# EAGLE design m1-alu (EAGLE 9.5.2)
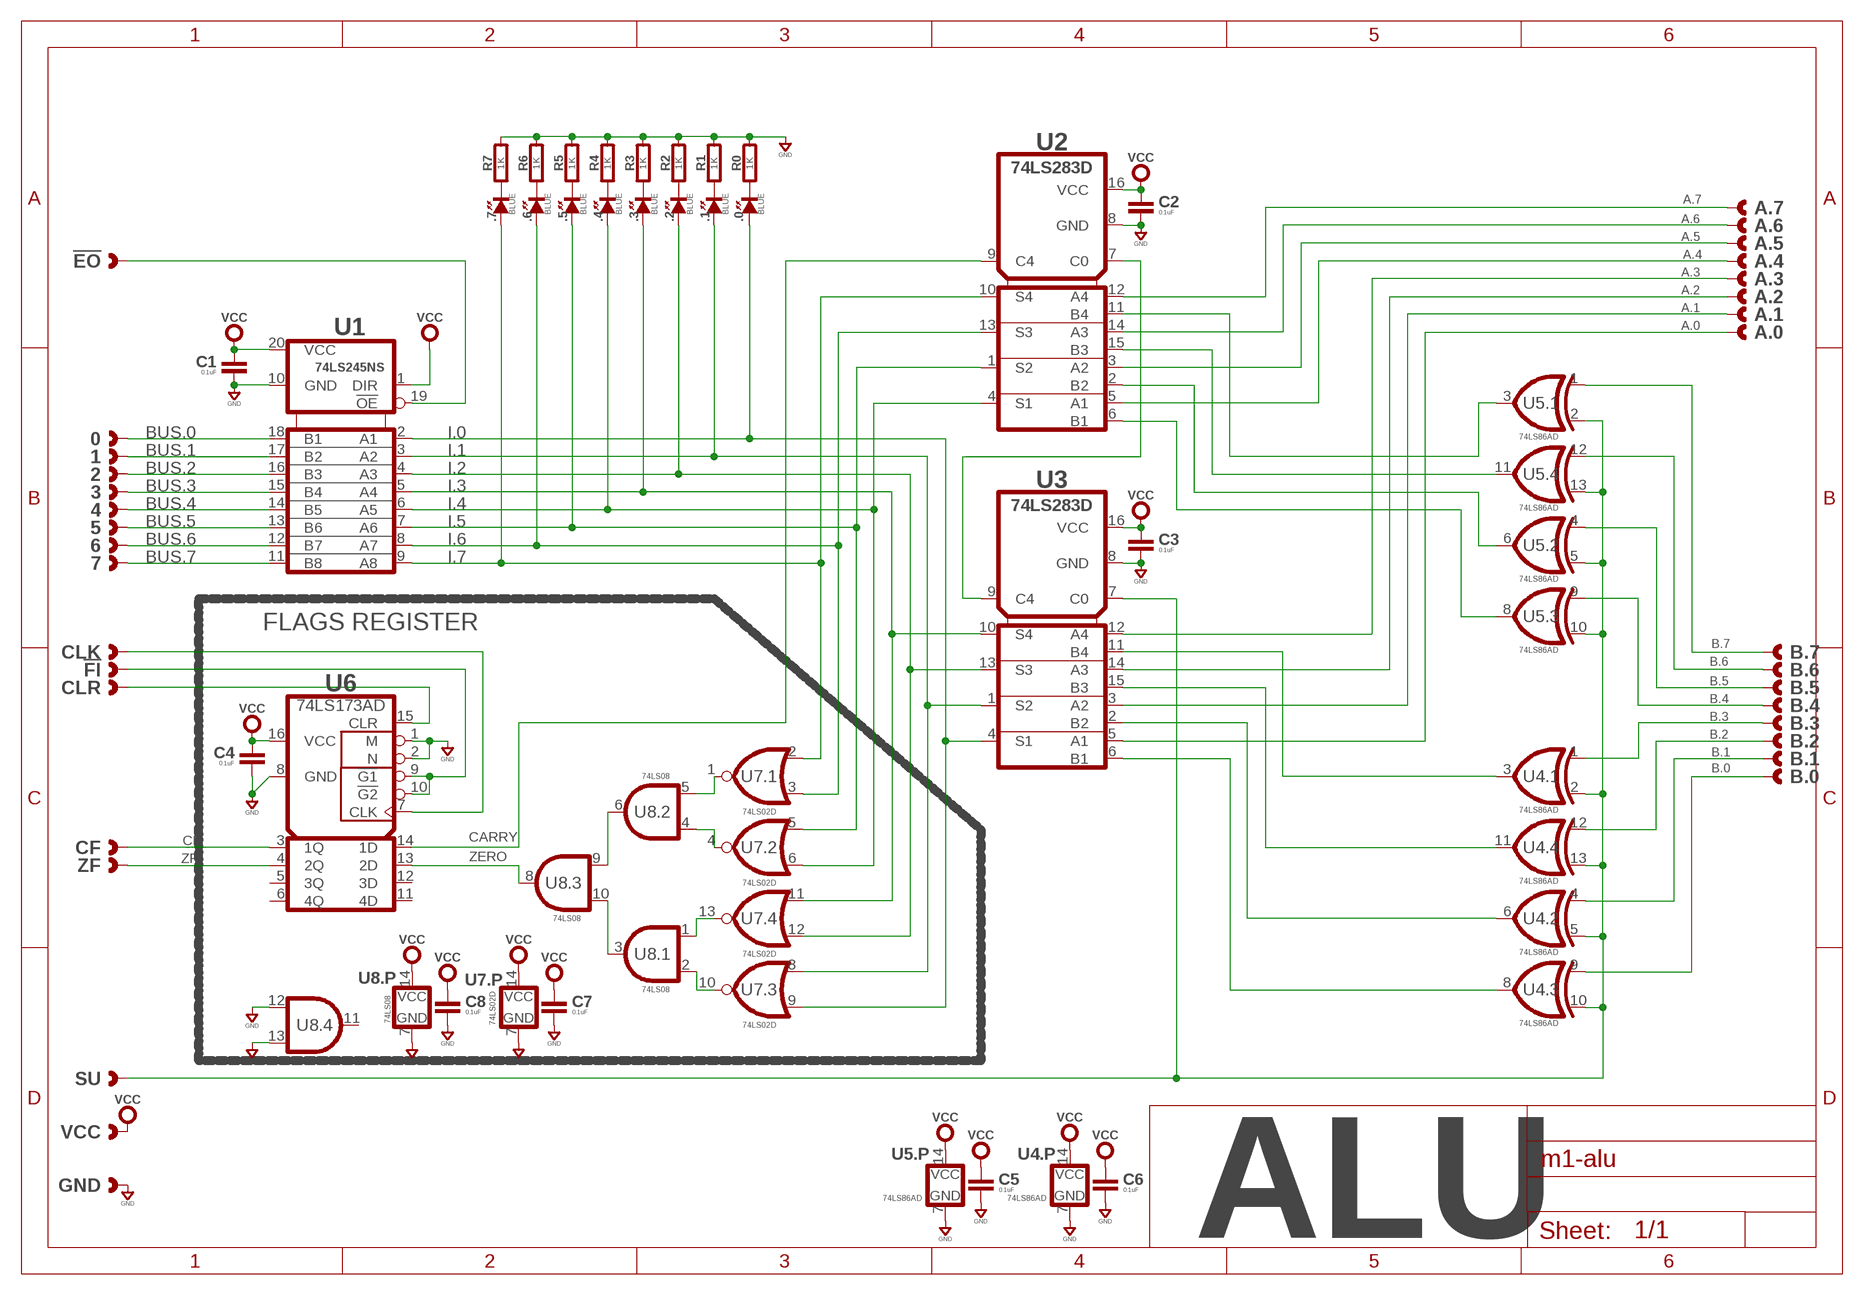
[diagram p0: schematic, sheet 1]

## Parts
0  CAST-01X1  [CAST01-2.54MM]
1  CAST-01X1  [CAST01-2.54MM]
2  CAST-01X1  [CAST01-2.54MM]
3  CAST-01X1  [CAST01-2.54MM]
4  CAST-01X1  [CAST01-2.54MM]
5  CAST-01X1  [CAST01-2.54MM]
6  CAST-01X1  [CAST01-2.54MM]
7  CAST-01X1  [CAST01-2.54MM]
!EO  CAST-01X1  [CAST01-2.54MM]
!FI  CAST-01X1  [CAST01-2.54MM]
.0  BLUE  SMT0603  [SMD_0603]
.1  BLUE  SMT0603  [SMD_0603]
.2  BLUE  SMT0603  [SMD_0603]
.3  BLUE  SMT0603  [SMD_0603]
.4  BLUE  SMT0603  [SMD_0603]
.5  BLUE  SMT0603  [SMD_0603]
.6  BLUE  SMT0603  [SMD_0603]
.7  BLUE  SMT0603  [SMD_0603]
A.0  CAST-01X1  [CAST01-2.54MM]
A.1  CAST-01X1  [CAST01-2.54MM]
A.2  CAST-01X1  [CAST01-2.54MM]
A.3  CAST-01X1  [CAST01-2.54MM]
A.4  CAST-01X1  [CAST01-2.54MM]
A.5  CAST-01X1  [CAST01-2.54MM]
A.6  CAST-01X1  [CAST01-2.54MM]
A.7  CAST-01X1  [CAST01-2.54MM]
B.0  CAST-01X1  [CAST01-2.54MM]
B.1  CAST-01X1  [CAST01-2.54MM]
B.2  CAST-01X1  [CAST01-2.54MM]
B.3  CAST-01X1  [CAST01-2.54MM]
B.4  CAST-01X1  [CAST01-2.54MM]
B.5  CAST-01X1  [CAST01-2.54MM]
B.6  CAST-01X1  [CAST01-2.54MM]
B.7  CAST-01X1  [CAST01-2.54MM]
C1  0.1uF  CAPACITOR0603  [0603-CAP]
C2  0.1uF  CAPACITOR0603  [0603-CAP]
C3  0.1uF  CAPACITOR0603  [0603-CAP]
C4  0.1uF  CAPACITOR0603  [0603-CAP]
C5  0.1uF  CAPACITOR0603  [0603-CAP]
C6  0.1uF  CAPACITOR0603  [0603-CAP]
C7  0.1uF  CAPACITOR0603  [0603-CAP]
C8  0.1uF  CAPACITOR0603  [0603-CAP]
CF  CAST-01X1  [CAST01-2.54MM]
CLK  CAST-01X1  [CAST01-2.54MM]
CLR  CAST-01X1  [CAST01-2.54MM]
GND  CAST-01X1  [CAST01-2.54MM]
R0  1K  RESISTOR0603  [0603-RES]
R1  1K  RESISTOR0603  [0603-RES]
R2  1K  RESISTOR0603  [0603-RES]
R3  1K  RESISTOR0603  [0603-RES]
R4  1K  RESISTOR0603  [0603-RES]
R5  1K  RESISTOR0603  [0603-RES]
R6  1K  RESISTOR0603  [0603-RES]
R7  1K  RESISTOR0603  [0603-RES]
SU  CAST-01X1  [CAST01-2.54MM]
U1  74LS245NS  [SO20]
U2  74LS283D  [SO16]
U3  74LS283D  [SO16]
U4  74LS86AD  74LS86D  [SOP14]
U5  74LS86AD  74LS86D  [SOP14]
U6  74LS173AD  [SO16]
U7  74LS02D  [SOP14]
U8  74LS08  74LS08D  [SOP14]
VCC  CAST-01X1  [CAST01-2.54MM]
ZF  CAST-01X1  [CAST01-2.54MM]

## Nets
A.0: A.0.1 U3.5(A1)
A.1: A.1.1 U3.3(A2)
A.2: A.2.1 U3.14(A3)
A.3: A.3.1 U3.12(A4)
A.4: A.4.1 U2.5(A1)
A.5: A.5.1 U2.3(A2)
A.6: A.6.1 U2.14(A3)
A.7: A.7.1 U2.12(A4)
B.0: B.0.1 U4.9(.3:A)
B.1: B.1.1 U4.4(.2:A)
B.2: B.2.1 U4.12(.4:A)
B.3: B.3.1 U4.1(.1:A)
B.4: B.4.1 U5.9(.3:A)
B.5: B.5.1 U5.4(.2:A)
B.6: B.6.1 U5.12(.4:A)
B.7: B.7.1 U5.1(.1:A)
BUS.0: 0.1 U1.18(B1)
BUS.1: 1.1 U1.17(B2)
BUS.2: 2.1 U1.16(B3)
BUS.3: 3.1 U1.15(B4)
BUS.4: 4.1 U1.14(B5)
BUS.5: 5.1 U1.13(B6)
BUS.6: 6.1 U1.12(B7)
BUS.7: 7.1 U1.11(B8)
CARRY: U2.9(C4) U6.14(1D)
CF: CF.1 U6.3(1Q)
GND: C1.2 C2.2 C3.2 C4.2 C5.2 C6.2 C7.2 C8.2 GND.1 R0.2 R1.2 R2.2 R3.2 R4.2 R5.2 R6.2 R7.2 U1.10(GND) U2.8(GND) U3.8(GND) U4.7(.P:GND) U5.7(.P:GND) U6.1(M) U6.2(N) U6.8(GND) U7.7(.P:GND) U8.7(.P:GND) U8.12(.4:A) U8.13(.4:B)
I.0: .0.A U1.2(A1) U3.4(S1) U7.9(.3:B)
I.1: .1.A U1.3(A2) U3.1(S2) U7.8(.3:A)
I.2: .2.A U1.4(A3) U3.13(S3) U7.12(.4:B)
I.3: .3.A U1.5(A4) U3.10(S4) U7.11(.4:A)
I.4: .4.A U1.6(A5) U2.4(S1) U7.6(.2:B)
I.5: .5.A U1.7(A6) U2.1(S2) U7.5(.2:A)
I.6: .6.A U1.8(A7) U2.13(S3) U7.3(.1:B)
I.7: .7.A U1.9(A8) U2.10(S4) U7.2(.1:A)
N$33: U2.7(C0) U3.9(C4)
N$34: SU.1 U3.7(C0) U4.2(.1:B) U4.5(.2:B) U4.10(.3:B) U4.13(.4:B) U5.2(.1:B) U5.5(.2:B) U5.10(.3:B) U5.13(.4:B)
N$35: U2.11(B4) U5.3(.1:Y)
N$36: U2.15(B3) U5.11(.4:Y)
N$37: U2.2(B2) U5.6(.2:Y)
N$38: U2.6(B1) U5.8(.3:Y)
N$39: U3.6(B1) U4.8(.3:Y)
N$40: U3.2(B2) U4.6(.2:Y)
N$41: U3.15(B3) U4.11(.4:Y)
N$42: U3.11(B4) U4.3(.1:Y)
N$43: U7.1(.1:Y) U8.5(.2:B)
N$44: U7.4(.2:Y) U8.4(.2:A)
N$45: U8.6(.2:Y) U8.9(.3:A)
N$46: U8.3(.1:Y) U8.10(.3:B)
N$47: U7.13(.4:Y) U8.1(.1:A)
N$48: U7.10(.3:Y) U8.2(.1:B)
N$49: !EO.1 U1.19(!OE)
N$50: .0.K(C) R0.1
N$51: .1.K(C) R1.1
N$52: .2.K(C) R2.1
N$53: .3.K(C) R3.1
N$54: .4.K(C) R4.1
N$55: .5.K(C) R5.1
N$56: .6.K(C) R6.1
N$57: .7.K(C) R7.1
N$58: !FI.1 U6.9(!G1) U6.10(!G2)
N$59: CLK.1 U6.7(CLK)
N$60: CLR.1 U6.15(CLR)
N$61: U1.1(DIR) ; supply symbol labelled VCC
VCC: C1.1 C2.1 C3.1 C4.1 C5.1 C6.1 C7.1 C8.1 U1.20(VCC) U2.16(VCC) U3.16(VCC) U4.14(.P:VCC) U5.14(.P:VCC) U6.16(VCC) U7.14(.P:VCC) U8.14(.P:VCC) VCC.1
ZERO: U6.13(2D) U8.8(.3:Y)
ZF: U6.4(2Q) ZF.1
Unconnected: U6.5(3Q) U6.6(4Q) U6.11(4D) U6.12(3D) U8.11(.4:Y)

## Notes on the sheet
- FLAGS REGISTER
- ALU

## Library data of the parts
0 1-7 !EO !FI A.0 A.1-A.7 B.0 B.1-B.7 CF CLK CLR GND SU VCC ZF = con-headers:CAST-01X1: Castelated Edge Hole Pad
.0 .1-.7 = led:SMT: LED SMT
C1-C8 = rlc:CAPACITOR: Capacitor CAP
R0 R1-R7 = rlc:RESISTOR: Resistor
U1 = logic:74*245?: 74245 Octal Transceiver
U2 U3 = logic:74*283?: 4-bit Adder
U4 U5 = logic:74*86?: Quad XOR Gate
U6 = logic:74*173A?: 74*173 Logic
U7 = logic:74*02?: Quad NOR Gate
U8 = logic:74*08?: 7408 Quad AND Gate

## Board
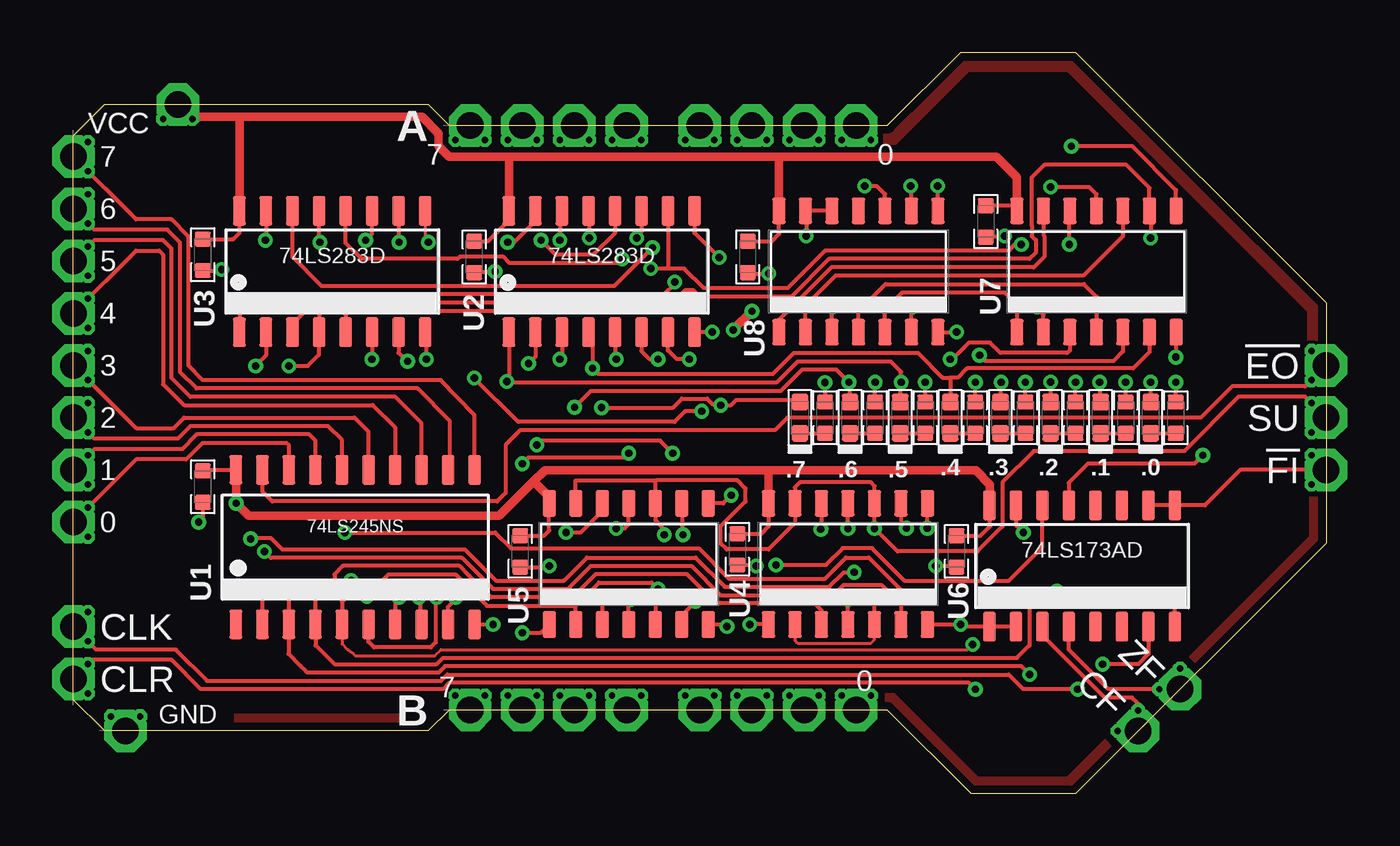
[diagram p1: board, top side]
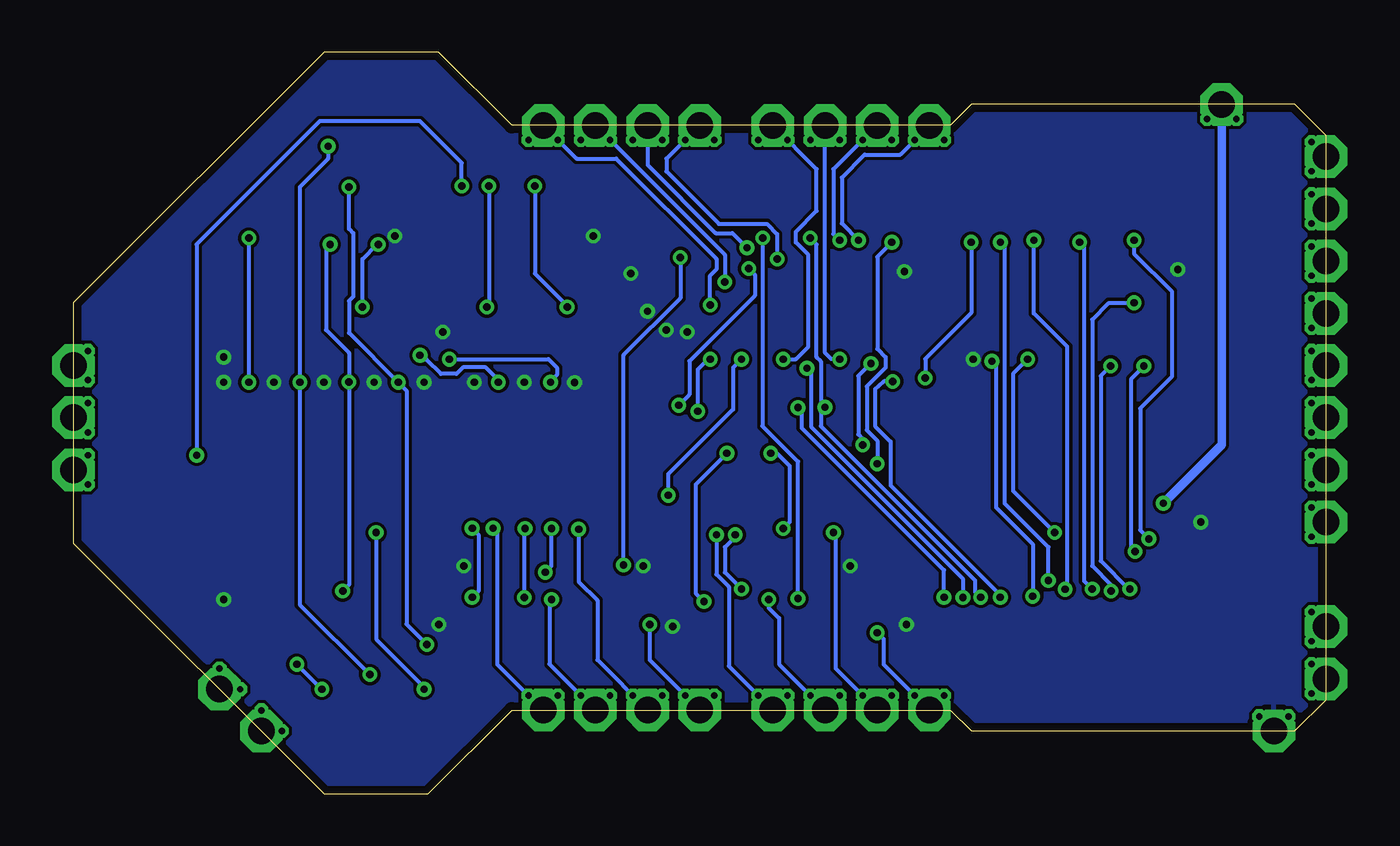
[diagram p2: board, bottom side, seen from below]

Size 60 x 35.5 mm. Coordinates in mm from the lower left corner, seen from the top.
Outline: 0,4.5 0,31.5 1.5,33 17,33 18,32 39,32 42.5,35.5 48,35.5 60,23.5 60,12 48,0 43,0 39,4 18,4 17,3 1.5,3 0,4.5
Copper layers (1*16): Top 0.0356mm / dielectric 1.5011mm / Bottom 0.0356mm
Design rules "OSH-CircuitMonkey *": minimum track width 6mil, minimum drill 13mil, track to track 6mil, track to pad 6mil, pad to pad 6mil, via to via 6mil, smd to smd 6mil, copper to edge 15mil, drill to drill 6mil, minimum pad ring 7mil, minimum via ring 7mil, stop-mask expansion 3mil, vias tented up to drill 14mil, thermal gap 10mil

### Footprints (pad centres in the part's own frame; a part is rotated, then mirrored left to right if it is on the bottom)
CAST01-2.54MM = drill 1.27 pad 2.032 octagon: 1 0,0 | drill 0.305 octagon: P$1 -0.7,0.7; P$2 -0.7,-0.7
SMD_0603 = smd 0.8 x 0.8: A 0.75,0; K -0.75,0
0603-CAP = smd 0.711 x 0.762: 1 -0.752,0; 2 0.752,0
0603-RES = smd 0.711 x 0.762: 1 -0.752,0; 2 0.752,0
SO20 = smd 0.6 x 1.4: 1 -5.715,-3.7; 2 -4.445,-3.7; 3 -3.175,-3.7; 4 -1.905,-3.7; 5 -0.635,-3.7; 6 0.635,-3.7; 7 1.905,-3.7; 8 3.175,-3.7; 9 4.445,-3.7; 10 5.715,-3.7; 11 5.715,3.7; 12 4.445,3.7; 13 3.175,3.7; 14 1.905,3.7; 15 0.635,3.7; 16 -0.635,3.7; 17 -1.905,3.7; 18 -3.175,3.7; 19 -4.445,3.7; 20 -5.715,3.7
SO16 = smd 0.6 x 1.4: 1 -4.445,-2.9; 2 -3.175,-2.9; 3 -1.905,-2.9; 4 -0.635,-2.9; 5 0.635,-2.9; 6 1.905,-2.9; 7 3.175,-2.9; 8 4.445,-2.9; 9 4.445,2.9; 10 3.175,2.9; 11 1.905,2.9; 12 0.635,2.9; 13 -0.635,2.9; 14 -1.905,2.9; 15 -3.175,2.9; 16 -4.445,2.9
SOP14 = smd 1.27 x 0.635: 1 -2.9,3.81; 2 -2.9,2.54; 3 -2.9,1.27; 4 -2.9,0; 5 -2.9,-1.27; 6 -2.9,-2.54; 7 -2.9,-3.81; 8 2.9,-3.81; 9 2.9,-2.54; 10 2.9,-1.27; 11 2.9,0; 12 2.9,1.27; 13 2.9,2.54; 14 2.9,3.81

### Placement (x,y rotation side)
0  0,13 180 top
1  0,15.5 180 top
2  0,18 180 top
3  0,20.5 180 top
4  0,23 180 top
5  0,25.5 180 top
6  0,28 180 top
7  0,30.5 180 top
!EO  60,20.5 0 top
!FI  60,15.5 0 top
.0  51.6,18 90 top
.1  49.2,18 90 top
.2  46.8,18 90 top
.3  44.4,18 90 top
.4  42,18 90 top
.5  39.6,18 90 top
.6  37.2,18 90 top
.7  34.8,18 90 top
A.0  37.5,32 90 top
A.1  35,32 90 top
A.2  32.5,32 90 top
A.3  30,32 90 top
A.4  26.5,32 90 top
A.5  24,32 90 top
A.6  21.5,32 90 top
A.7  19,32 90 top
B.0  37.5,4 270 top
B.1  35,4 270 top
B.2  32.5,4 270 top
B.3  30,4 270 top
B.4  26.5,4 270 top
B.5  24,4 270 top
B.6  21.5,4 270 top
B.7  19,4 270 top
C1  6.2,14.7 270 top
C2  19.2,25.7 270 top
C3  6.2,25.8 270 top
C4  31.8,11.7 270 top
C5  21.4,11.6 270 top
C6  42.3,11.6 270 top
C7  43.7,27.4 270 top
C8  32.3,25.7 270 top
CF  51,3 315 top
CLK  0,8 180 top
CLR  0,5.5 180 top
GND  2.5,3 270 top
R0  52.8,18 90 top
R1  50.4,18 90 top
R2  48,18 90 top
R3  45.6,18 90 top
R4  43.2,18 90 top
R5  40.8,18 90 top
R6  38.4,18 90 top
R7  36,18 90 top
SU  60,18 0 top
U1  13.5,11.8 0 top
U2  25.3,25 0 top
U3  12.4,25 0 top
U4  37.1,11 90 top
U5  26.6,11 90 top
U6  48.31,10.9 0 top
U7  49,25 90 top
U8  37.6,25 90 top
VCC  5,33 90 top
ZF  53,5 315 top

### Tracks (layer width: path | path; a pad name or v marks a point on that pad's centre or on a via)
A.0  (via drill 0.35)
  Top 0.2: v29.5,23.4 29.2,23.1 13.2,23.1 13.04,22.93 U3.5
  Bottom 0.2: A.0.1 35.9,30.4 34,30.4 29.2,25.6 29.2,25.1 29.5,24.8 v29.5,23.4
A.1  (via drill 0.35)
  Top 0.2: v28.8,24.5 28.8,24.4 28.3,23.9 11.9,23.9 10.49,22.5 U3.3
  Bottom 0.2: A.1.1 28.8,25.8 v28.8,24.5
A.2  (via drill 0.35)
  Top 0.2: v27.74,26.14 25.9,24.3 11.9,24.3 10.49,25.7 U3.14
  Bottom 0.2: A.2.1 32.5,30.1 29.24,26.84 28.44,26.84 v27.74,26.14
A.3  (via drill 0.35)
  Top 0.2: v26.3,25.59 26.1,25.4 20.9,25.4 20.6,25.7 18.5,25.7 18.4,25.6 13.8,25.6 13.04,26.36 U3.12
  Bottom 0.2: v26.3,25.59 26.3,26.8 26.78,27.28 29.09,27.28 31.6,29.8 31.6,30.4 A.3.1
A.4  (via drill 0.35)
  Top 0.2: v26,20.8 25.94,20.86 U2.5
  Bottom 0.2: A.4.1 24.4,29.9 24.4,27.9 25.4,26.9 25.4,26.4 24.8,25.8 24.8,21.4 25.4,20.8 v26,20.8
A.5  (via drill 0.35)
  Top 0.2: U2.3 23.4,20.9 v23.3,20.8
  Bottom 0.2: A.5.1 24,21.1 23.7,20.8 v23.3,20.8
A.6  (via drill 0.35)
  Top 0.2: U2.14 23.3,27.8 v23.3,26.5
  Bottom 0.2: v23.3,26.5 23.6,26.8 23.6,29.9 A.6.1
A.7  (via drill 0.35)
  Top 0.2: v22.4,26.5 23.1,25.8 24.9,25.8 25.94,26.84 U2.12
  Bottom 0.2: A.7.1 20.4,30.6 22.1,30.6 23.2,29.5 23.2,27.3 v22.4,26.5
AAA
  pour Top: 15.7,3.4 15.7,3.8 7.7,3.8 7.7,3.4
B.0  (via drill 0.35)
  Top 0.2: U4.9 39.64,12.96 v39.9,12.71
  Bottom 0.2: B.0.1 39.7,6.2 39.7,12.51 v39.9,12.71
B.1  (via drill 0.35)
  Top 0.2: U4.4 v37.1,9.3
  Bottom 0.2: B.1.1 37.2,6.2 37.2,9.2 v37.1,9.3
B.2  (via drill 0.35)
  Top 0.2: U4.12 35.83,12.65 v35.8,12.65
  Bottom 0.2: B.2.1 34.9,6.4 34.9,9.25 35.8,10.16 v35.8,12.65
B.3  (via drill 0.35)
  Top 0.2: U4.1 v32.4,8.1
  Bottom 0.2: v32.4,8.1 32.4,6.4 B.3.1
B.4  (via drill 0.35)
  Top 0.2: U5.9 29.14,12.46 v29.2,12.4
  Bottom 0.2: B.4.1 28.6,6.1 28.6,9.9 29.2,10.5 v29.2,12.4
B.5  (via drill 0.35)
  Top 0.2: U5.4 26.6,9.2 v26.7,9.3
  Bottom 0.2: B.5.1 26.2,6.2 26.2,8.4 26.7,8.9 v26.7,9.3
B.6  (via drill 0.35)
  Top 0.2: U5.12 25.33,13.53 24.3,12.5 v23.6,12.5
  Bottom 0.2: B.6.1 23.5,6 23.5,12.4 v23.6,12.5
B.7  (via drill 0.35)
  Top 0.2: v21.5,7.71 22.39,7.71 U5.1
  Bottom 0.2: B.7.1 21.2,6.2 21.2,7.41 v21.5,7.71
BBB
  pour Top: 38.8,31.6 38.8,31.1 39.4,31.1 42.9,34.6 47.6,34.6 59.1,23.1 59.1,21.7 59.6,21.7 59.6,23.4 47.9,35.1 42.6,35.1 39.1,31.6
BUS.0
  Top 0.2: U1.18 10.32,16.68 10.2,16.8 6.2,16.8 5.4,16 3,16 0.1
BUS.1
  Top 0.2: U1.17 11.6,16.9 11.3,17.2 5.9,17.2 5.2,16.5 1,16.5 1.1
BUS.2
  Top 0.2: U1.16 12.87,16.93 12.2,17.6 5.6,17.6 5,17 1,17 2.1
BUS.3
  Top 0.2: U1.15 14.13,17.33 13.47,18 5.3,18 4.8,17.5 3,17.5 3.1
BUS.4
  Top 0.2: U1.14 15.4,17.53 14.34,18.6 5.3,18.6 4.3,19.6 4.3,25.8 4.1,26 3,26 4.1
BUS.5
  Top 0.2: U1.13 16.68,17.73 15.41,19 5.6,19 4.7,19.9 4.7,26.1 4.3,26.5 1,26.5 5.1
BUS.6
  Top 0.2: U1.12 18.03,15.58 18.03,17.85 16.48,19.4 5.9,19.4 5.1,20.2 5.1,26.4 4.5,27 1,27 6.1
BUS.7
  Top 0.2: U1.11 19.21,18.12 17.59,19.8 6.2,19.8 5.5,20.5 5.5,26.7 4.7,27.5 3,27.5 7.1
CARRY  (via drill 0.35)
  Top 0.2: U2.9 29.75,26.85 v30.93,25.67 | v33.65,10.95 36.05,10.95 36.85,11.75 38.25,11.75 39.8,10.2 44.8,10.2 46.41,11.81 U6.14
  Bottom 0.2: v30.93,25.67 30.93,23.73 33.65,21.01 v33.65,10.95
CCC
  pour Top: 38.9,4.4 38.9,4.8 39.3,4.8 43.3,0.8 47.6,0.8 49.4,2.6 49.75,2.25 47.9,0.4 43.1,0.4 39.1,4.4
CF
  Top 0.2: CF.1 51,4.3 50.7,4.6 49.4,4.6 46.41,7.59 U6.3
EEE
  pour Top: 59.6,14.2 59.2,14.2 59.2,12.3 53.45,6.55 53.75,6.25 59.6,12.1
GND  (via drill 0.35)
  Top 0.2: U3.8 16.9,22.05 v16.9,20.8 | v36,19.69 R7.2 | R6.2 38.4,19.25 | 38.4,19.25 | 38.4,19.25 v38.4,19.7 | R5.2 40.8,19.25 | 40.8,19.25 | 40.8,19.25 v40.8,19.7 | R4.2 43.2,19.25 | 43.2,19.25 | 43.2,19.25 v43.2,19.7 | R3.2 45.6,19.25 | 45.6,19.25 | 45.6,19.25 v45.6,19.7 | R2.2 48,19.25 | 48,19.25 | 48,19.25 v48,19.7 | R1.2 50.4,19.25 | 50.4,19.25 | 50.4,19.25 v50.4,19.7 | v52.8,19.7 52.8,19.25 | R0.2 52.8,19.25 | 52.8,19.25 | C3.2 7.05,25.05 v7.1,25.1 | C2.2 19.25,25 v20.2,25 | U1.10 v20.1,8.1 | C5.2 22.75,10.85 v22.8,10.9 | U6.2 U6.1 42.6,8 v42.5,8.1 U4.7 | U5.7 31.2,8.1 v31.3,8 | C4.2 32.65,10.95 v32.7,10.9 | U8.7 v42.3,22.1 | U6.8 52.76,9.26 v52.8,9.3 | v41.3,10.9 42.25,10.9 C6.2 | C1.2 6.2,13.2 v6,13 | U2.8 v30.6,22.1 | C8.2 32.35,24.9 v33.3,24.9 | U8.12 U8.13 35.1,27.86 v35.1,26.7 | C7.2 43.75,26.7 v44.6,26.7 | U7.7 v52.81,20.91 v52.8,20.9
  Top 0.406: v32.5,23.1 v31.6,22.2
  pour Bottom: 0,4.5 1.5,3 17,3 18,4 39,4 43,0 48,0 60,12 60,23.5 48,35.5 42.5,35.5 39,32 18,32 17,33 1.5,33 0,31.5
I.0  (via drill 0.35)
  Top 0.2: U1.2 9.05,9.46 v9.4,9.8 | v10.32,20.48 11.22,20.48 11.75,21 11.75,22.08 U3.4 11.77,23.07 12.2,23.5 28.7,23.5 29.3,24.1 29.7,24.1 30,23.8 34.4,23.8 36.2,25.6 45.8,25.6 46.1,25.9 46.1,26.5 45.9,26.7 45.9,27.21 45.89,27.22 45.89,29.49 46.5,30.1 50.44,30.1 51.54,29 U7.9 51.6,27.84 v51.6,26.6 | .0.A v51.6,19.7
  Bottom 0.2: v9.4,9.8 9.43,9.77 10.8,11.14 10.8,20 v10.32,20.48 | v51.6,26.6 v51.6,19.7
I.1  (via drill 0.35)
  Top 0.2: U1.3 10.32,9.68 v10.3,9.7 10.3,6.69 10.89,6.1 11.1,5.9 11.2,5.8 17.5,5.8 17.8,6.1 45.4,6.1 v45.8,5.7 | v9.2,23.5 8.4,23.5 7.96,23.05 U3.1 | U7.8 52.81,28.9 50.71,31 v47.8,31 | v49.15,19.7 49.15,18.8 .1.A
  Bottom 0.2: v10.3,9.7 10.3,10 11.2,10.9 11.2,22.7 10.4,23.5 v9.2,23.5 | v45.8,5.7 49.15,9.05 v49.15,19.7 49.15,29.05 47.8,30.4 v47.8,31
I.2  (via drill 0.35)
  Top 0.2: v11.2,9.8 11.6,9.41 U1.4 11.6,7.11 12.5,6.2 17.4,6.2 17.7,6.5 45.2,6.5 45.8,7.1 45.8,9 46.5,9.7 v47.1,9.7 | v11.8,26.41 11.77,26.44 U3.13 | v46.8,19.7 .2.A | v47.7,26.3 47.7,27.87 U7.12
  Bottom 0.2: v11.2,9.8 11.6,10.2 11.6,26.2 v11.8,26.4 v11.8,26.41 | v47.1,9.7 46.8,10 v46.8,19.7 46.8,21.1 47.9,22.2 47.9,26.1 v47.7,26.3
I.3  (via drill 0.35)
  Top 0.152: U1.5 12.87,7.17 13.13,6.9 13.4,6.7 13.5,6.6 17.3,6.6 17.6,6.9 42.83,6.9 v43.07,7.14
  Top 0.2: U3.10 15.57,26.41 v15.6,26.41 | v13.3,10.2 13.3,9.63 12.87,9.2 U1.5 | v44.44,19.7 44.4,19.66 .3.A | U7.11 49,28.7 48.66,29.04 v46.8,29.04
  Bottom 0.2: v15.6,26.41 15.4,26.2 15.4,13.9 13.3,11.8 v13.3,10.2 | v46.8,29.04 46.8,27.04 46.6,26.84 46.6,23.8 46.8,23.6 46.8,22.06 v44.44,19.7 44.04,19.3 44.04,8.11 v43.07,7.14
I.4  (via drill 0.35)
  Top 0.2: U2.4 24.87,21.9 v24.87,20.37 25.13,20.11 33.51,20.11 34.5,21.1 40.45,21.1 41.62,19.93 42,19.93 | v17.4,9.39 17.36,9.35 17.36,7.25 17.11,7 14.4,7 14.13,7.26 U1.6 | U7.6 51.54,21.14 50.76,20.36 42.8,20.36 42.37,19.93 42,19.93 | 42,19.93 .4.A
  Bottom 0.2: v17.4,9.39 17.4,10.3 24.67,17.57 24.67,20.17 v24.87,20.37
I.5  (via drill 0.35)
  Top 0.2: U2.1 20.86,19.84 v20.76,19.74 20.8,19.7 33.7,19.7 34.7,20.7 39.14,20.7 39.64,20.2 v39.64,19.7 39.59,19.7 .5.A | v15.61,9.41 v15.61,9.4 15.4,9.2 U1.7 | U7.5 50.27,21.18 49.8,20.71 43.69,20.71 v43.4,21
  Bottom 0.2: v20.76,19.74 21.18,19.74 21.6,19.35 21.6,17.6 20.86,16.86 20.86,14.76 15.61,9.5 v15.61,9.41 | v39.64,19.7 39.64,19.8 40.25,20.41 41.34,20.41 41.65,20.09 42.4,20.09 43.1,20.8 43.2,20.8 v43.4,21
I.6  (via drill 0.35)
  Top 0.2: U1.8 16.6,8.18 16.6,9.34 v16.54,9.4 | U2.13 24.7,27.86 v24.7,26.61 | U7.3 47.73,21.23 47.6,21.1 44.4,21.1 43.9,21.6 42.9,21.6 42.16,20.86 42.06,20.86 v42,20.8 | v24,18.5 24.79,19.29 33.89,19.29 34.9,20.3 36.54,20.3 v37.14,19.7 37.18,19.66 37.18,18.77 .6.A
  Bottom 0.2: v16.54,9.4 16.8,9.66 16.8,10.2 24.2,17.6 24.2,18.3 v24,18.5 24.2,18.7 24.2,20.7 24.4,20.9 24.4,26.3 v24.7,26.61 | v37.14,19.7 36.84,20.05 36.84,20.4 37.24,20.8 v42,20.8
I.7  (via drill 0.35)
  Top 0.2: .7.A 34.7,18.85 31.75,18.85 31.5,18.6 v31,18.6 31,18.65 30.61,18.65 30.35,18.91 29.15,18.91 28.72,18.48 v25.3,18.48 | U7.2 46.46,22.94 46.16,23.24 v46.16,23.3 | v45.4,26.3 45.1,26.3 44.8,26 36,26 34.2,24.2 30.2,24.2 29.26,25.14 28.5,25.14 | U1.9 17.95,8.95 18.3,9.3 v18.3,9.4 | 28.5,25.14 v27.66,25.14 | 28.5,25.14 28.48,25.16 U2.10
  Bottom 0.2: v27.66,25.14 27.36,24.84 27.36,23.84 30.5,20.7 30.5,19.11 v31,18.6 | v46.16,23.3 46.16,25.59 45.46,26.3 v45.4,26.3 | v18.3,9.4 18.3,10.7 25.12,17.52 25.12,18.3 v25.3,18.48
N$33  (via drill 0.35)
  Top 0.152: U3.9 16.84,26.56 v17,26.41 | v30.1,18.3 30.08,18.33 30,18.3
  Top 0.2: v19.2,19.9 21.3,17.8 28.8,17.8 29.3,18.3 30,18.3 | v29.5,20.8 28.9,20.8 28.48,21.22 U2.7
  Bottom 0.2: v17,26.41 17,23.02 19.2,20.82 v19.2,19.9 | v30.1,18.3 30.1,20.3 29.6,20.8 v29.5,20.8
N$34  (via drill 0.35)
  Top 0.152: U4.2 34.56,7.34 34.69,7.21 38.21,7.21 38.37,7.37 U4.5
  Top 0.2: SU.1 59,19 55.8,19 53.2,16.4 46,16.4 44.5,14.9 44.5,12.8 43.3,11.6 39.47,11.6 v38.37,12.7 U4.10 38.37,14.73 38.2,14.9 34.8,14.9 34.56,14.66 U4.13 34.56,12.96 33.3,11.7 31.3,11.7 31,12 31,12.8 32.2,14 32.2,14.6 31.8,15 27.87,15 | v16,20.7 15.97,20.7 15.57,21.1 U3.7 | v14.05,9.45 15.1,10.5 18.3,10.5 19.81,8.99 24.06,8.99 | v28.3,12.4 28.3,12.67 27.87,13.1 U5.10 27.87,15 | U5.13 24.06,15 27.87,15 | U5.5 27.87,9.67 v28,9.8 27.7,10.1 25.17,10.1 24.06,8.99 | U5.2 24.06,8.99 | U4.5 38.37,9.27 38.4,9.3 v38.4,9.39
  Bottom 0.2: v16,20.7 15.8,20.5 15.8,13.71 14.05,11.95 v14.05,9.45 | v28.3,12.4 28.3,12.3 28.8,11.8 28.8,10.6 v28,9.8 | v38.4,9.39 38.4,12.7 v38.37,12.7
N$35  (via drill 0.35)
  Top 0.2: v25.3,9.34 25.33,9.3 U5.3 | U2.11 27.21,26.91 26.98,26.68 v26.98,26.6
  Bottom 0.2: v25.3,9.34 25.3,15.89 27,17.6 27,26.58 v26.98,26.6
N$36  (via drill 0.35)
  Top 0.2: U2.15 22.13,27.43 21.1,26.4 v20.8,26.4 | v26.6,16.3 26.4,16.09 21.8,16.09 v21.5,15.8 | v26,12.7 26.4,12.7 26.6,12.9 U5.11
  Bottom 0.2: v20.8,26.4 21.5,25.7 21.5,21.3 21.1,20.9 21.1,20.4 22,19.5 22,17.4 21.5,16.9 v21.5,15.8 | v26,12.7 25.7,13 25.7,15.7 26.3,16.3 v26.6,16.3
N$37  (via drill 0.35)
  Top 0.2: U2.2 22.13,20.93 v21.8,20.6 | v22.2,16.7 22.4,16.9 28.1,16.9 v28.7,16.3 | U5.6 29.14,8.54 v29.8,9.2
  Bottom 0.2: v21.8,20.6 22.4,20 22.4,17.2 22.2,17 v22.2,16.7 | v28.7,16.3 30.2,14.8 30.2,9.6 v29.8,9.2
N$38  (via drill 0.35)
  Top 0.2: U2.6 27.21,21.19 27.6,20.8 v28,20.8 | v31.51,14.29 31.12,13.9 U5.8
  Bottom 0.2: v28,20.8 28.4,20.4 28.4,18.4 31.51,15.29 v31.51,14.29
N$39  (via drill 0.35)
  Top 0.2: U3.6 14.3,21 v14.3,20.8 | v13,12.5 20.2,12.5 20.96,11.74 29.95,11.74 31.4,10.29 32.95,10.29 32.96,10.3 36,10.3 37,11.3 38.1,11.3 40,9.4 v40.9,9.4 | v40.9,12.71 U4.8
  Bottom 0.2: v14.3,20.8 15,20.1 15,14.5 v13,12.5 | v40.9,9.4 40.6,9.7 40.6,12.4 v40.9,12.71
N$40  (via drill 0.35)
  Top 0.2: U3.2 9.22,21 8.72,20.5 v8.72,20.48 | v9.15,11.6 9.45,11.29 18.61,11.29 20.1,9.8 23.7,9.8 24.8,10.9 29.6,10.9 31,9.5 36.4,9.5 36.9,10 38.7,10 39.64,9.06 U4.6
  Bottom 0.2: v8.72,20.48 9.32,19.88 9.32,11.77 v9.15,11.6
N$41  (via drill 0.35)
  Top 0.2: U3.15 9.22,26.62 9.2,26.6 v9.2,26.5 | v8.49,12.2 8.49,12.25 9.45,12.25 10,11.7 18.74,11.7 20.24,10.2 23.5,10.2 24.6,11.3 29.8,11.3 31.2,9.9 36.2,9.9 36.9,10.6 v37.4,10.6 v37.4,10.61 | v37.1,12.7 U4.11
  Bottom 0.2: v9.2,26.5 9.2,25.86 7.4,24.06 7.4,19.96 8.9,18.45 8.9,12.61 v8.49,12.2 | v37.4,10.61 37.1,10.91 v37.1,12.7
N$42  (via drill 0.35)
  Top 0.2: U4.3 35.83,8.77 35.49,9.11 30.79,9.11 29.4,10.5 25,10.5 23.9,9.4 20,9.4 19.95,9.45 18.96,10.44 18.49,10.9 12.9,10.9 12.5,10.5 v12.5,9.79 | v14,26.5 v14.01,26.5 14.3,26.8 U3.11
  Bottom 0.2: v12.5,9.79 12.39,9.79 12.39,21.39 14,23 v14,26.5
N$43
  Top 0.2: U8.5 38.87,23.16 39.71,24 44.6,24 45.2,23.4 U7.1
N$44
  Top 0.2: U8.4 37.6,23.1 38.9,24.4 48.4,24.4 49,23.8 U7.4
N$45  (via drill 0.35)
  Top 0.2: U8.9 40.14,29.06 v40.1,29.1 | U8.6 40.14,23.24 v40.2,23.3
  Bottom 0.2: v40.1,29.1 40.1,23.4 v40.2,23.3
N$46  (via drill 0.35)
  Top 0.2: v36.35,23.3 36.37,23.27 36.33,23.23 U8.3 | v37.9,29.1 38.47,29.1 38.87,28.7 U8.10
  Bottom 0.2: v37.9,29.1 37.9,24.9 36.35,23.35 v36.35,23.3
N$47
  Top 0.2: U7.13 46.46,26.74 46.5,26.7 46.5,25.7 46,25.2 36.3,25.2 33.79,22.69 U8.1
N$48
  Top 0.2: U7.10 50.27,26.7 48.37,24.8 36.5,24.8 35.06,23.36 U8.2
N$49
  Top 0.2: !EO.1 59,19.5 55.5,19.5 54,18 34.2,18 33.6,17.4 21.4,17.4 20.7,16.7 20.7,14.4 20.3,14 9.52,14 9.05,14.47 U1.19
N$50
  Top 0.2: .0.K R0.1
N$51
  Top 0.2: .1.K R1.1
N$52
  Top 0.2: .2.K R2.1
N$53
  Top 0.2: .3.K R3.1
N$54
  Top 0.2: .4.K R4.1
N$55
  Top 0.2: .5.K R5.1
N$56
  Top 0.2: .6.K R6.1
N$57
  Top 0.2: .7.K R7.1
N$58
  Top 0.2: !FI.1 55.9,15.5 54.2,13.8 U6.9 U6.10
N$59  (via drill 0.35)
  Top 0.2: CLK.1 1.1,6.9 4.9,6.9 6.4,5.4 17.6,5.4 17.9,5.7 44.8,5.7 45.5,5 v48.1,5 | U6.7 51.49,6.69 51,6.2 v49.3,6.2
  Bottom 0.2: v48.1,5 v49.3,6.2
N$60  (via drill 0.35)
  Top 0.2: CLR.1 0.9,6.4 4.7,6.4 6.1,5 17.7,5 18,5.3 42.9,5.3 v43.2,5 | U6.15 45.14,12.86 v45.5,12.5
  Bottom 0.2: v45.5,12.5 45.5,7.4 43.2,5.1 v43.2,5
VCC  (via drill 0.35)
  Top 0.2: C1.1 6.25,15.5 U1.20 | C3.1 7.65,26.55 7.96,26.86 U3.16 | C2.1 19.85,26.45 20.86,27.46 U2.16 | C8.1 33.45,26.45 33.8,26.8 U8.14 | U7.14 44.94,28.15 C7.1 | C6.1 43.45,12.35 43.9,12.8 43.9,13.83 | C5.1 22.55,12.35 22.79,12.59 U5.14 | C4.1 32.95,12.45 33.3,12.8 33.3,13.7
  Top 0.4: U7.14 45.19,29.51 44.2,30.5 33.8,30.5 | 33.8,30.5 20.8,30.5 | 20.8,30.5 18,30.5 17.5,31 17.5,31.6 16.7,32.4 8,32.4 | 8,32.4 5.6,32.4 VCC.1 | U3.16 7.96,32.36 8,32.4 | U2.16 20.86,30.44 20.8,30.5 | U8.14 33.79,30.49 33.8,30.5 | 33.29,15.49 22.59,15.49 22.05,14.95 | 22.05,14.95 20.4,13.3 8.4,13.3 v7.8,13.9 7.79,13.91 U1.20 | 43.22,15.48 43.9,14.8 43.9,13.83 U6.16 | U5.14 22.79,14.21 22.05,14.95
  Top 0.406: 43.22,15.48 33.29,15.48 | 33.3,13.7 U4.14 33.29,15.48 | 33.29,15.48 33.29,15.49
  Bottom 0.4: VCC.1 5,16.7 v7.8,13.9
ZERO  (via drill 0.35)
  Top 0.2: U8.8 v41.41,29.09 v41.4,29.1 | v54.1,16.2 53.7,15.8 48.6,15.8 47.68,14.88 U6.13
  Bottom 0.2: v41.4,29.1 41.4,30.2 43.4,32.2 48.2,32.2 54.1,26.3 v54.1,16.2
ZF
  Top 0.2: ZF.1 49.58,5 47.68,6.9 U6.4

### Text on the board
tPlace: A | 7 | 0 | 7 | 0 | B